# Altium project MainBoard.PrjPCB
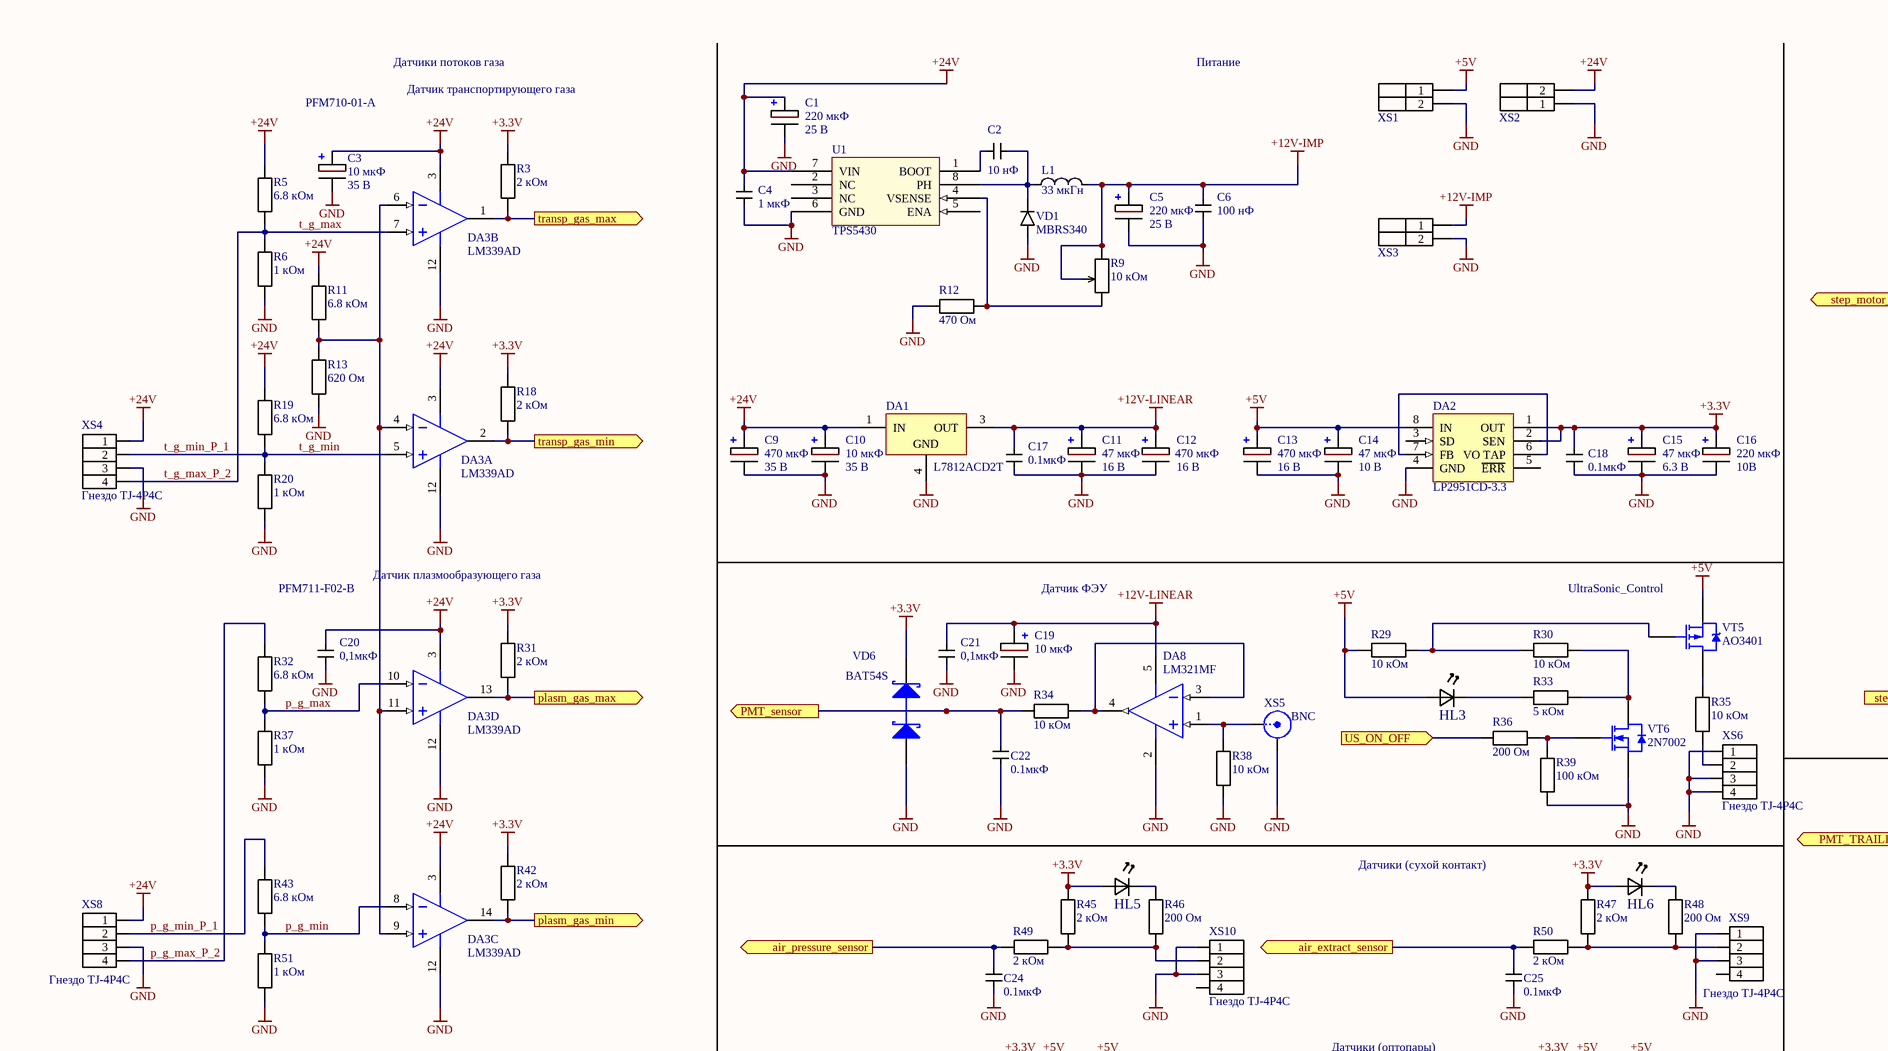
[diagram p0: MainBoard.SchDoc, top left]
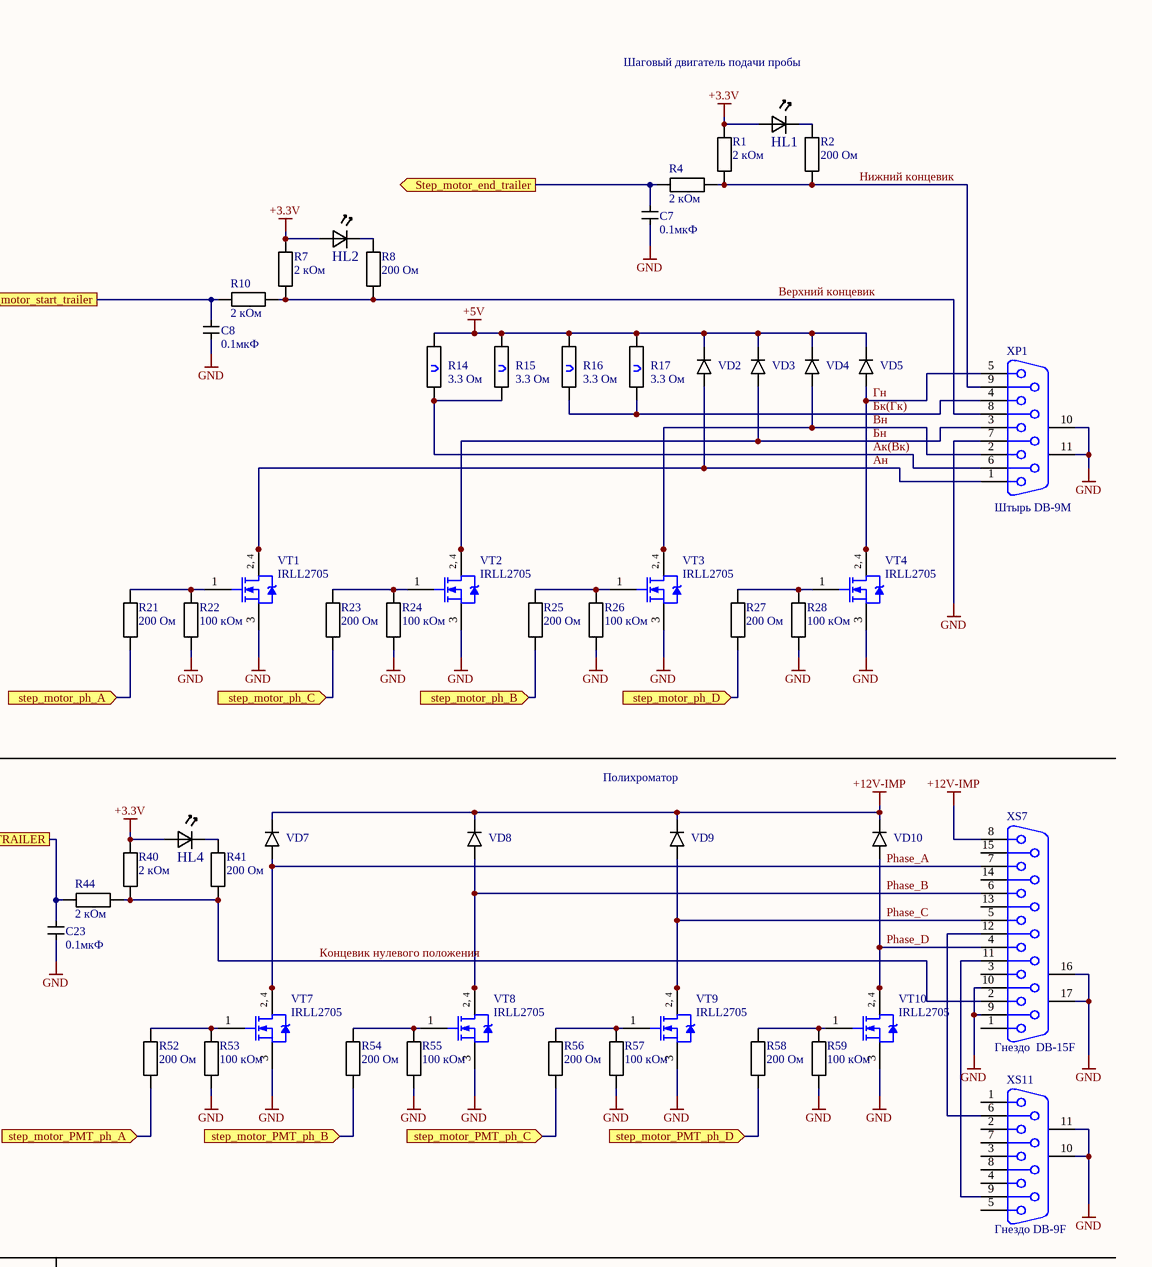
[diagram p1: MainBoard.SchDoc, top right]
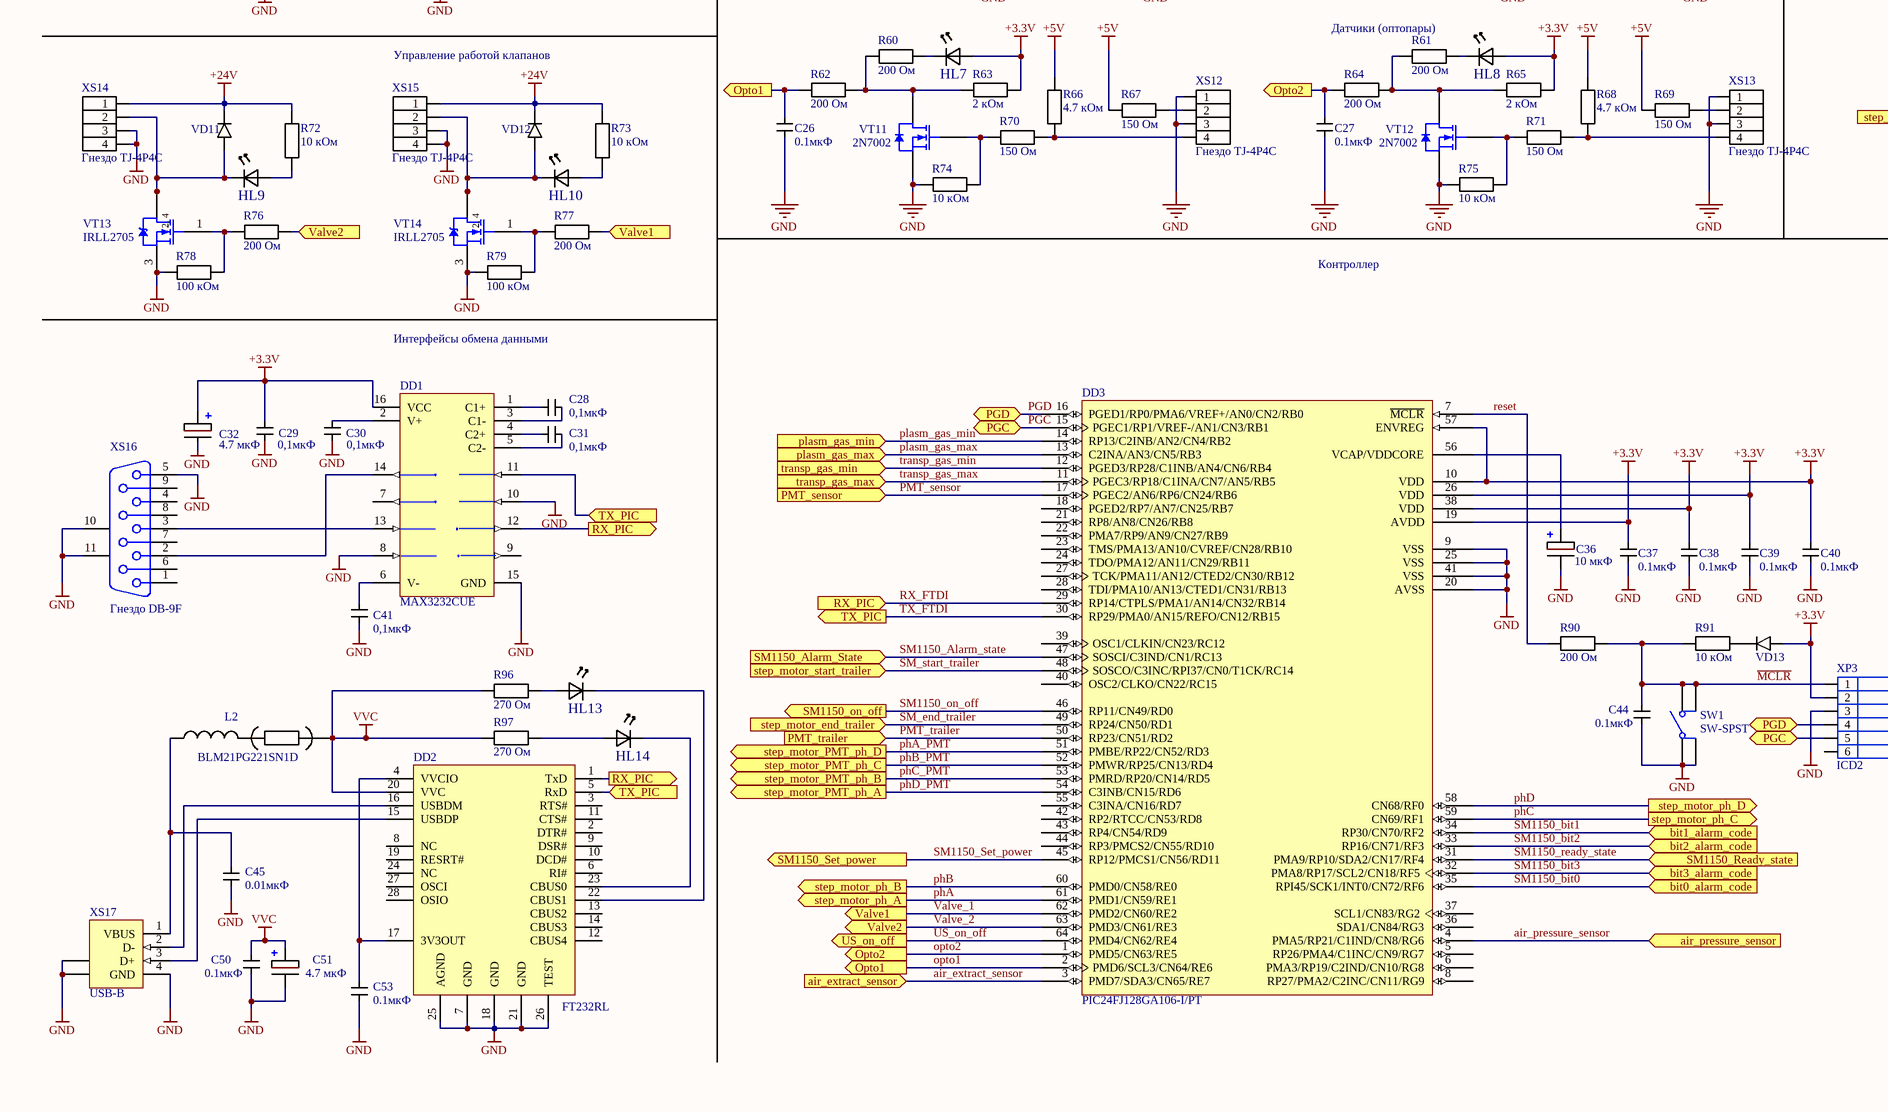
[diagram p2: MainBoard.SchDoc, bottom left]
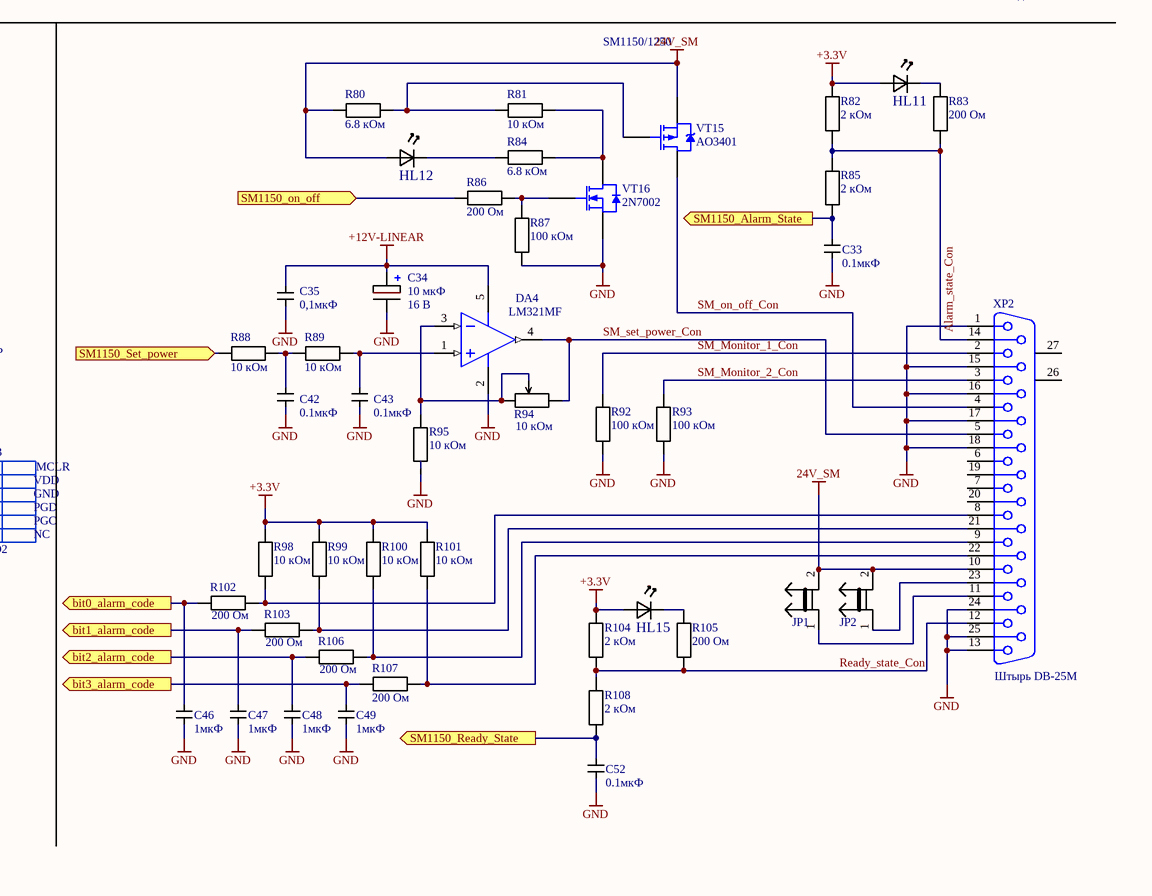
[diagram p3: MainBoard.SchDoc, bottom right]
1 sheet, 239 parts. Net scope: flat (ports and power ports of the same name join across sheets).
Board file: MainBoard.PcbDoc

## Sheet MainBoard.SchDoc
size A2

### Parts
C1  value 220 мкФ  napr: 25 В  [CAPPR5-14x20]  (hidden comment: Конденсатор К50-68)
C2  value 10 нФ  [CC2012-0805]  (hidden comment: Конденсатор ЧИП)
C3  value 10 мкФ  napr: 35 В  [C]  (hidden comment: Tantal C case)
C4  value 1 мкФ  [CC2012-0805]  (hidden comment: Конденсатор ЧИП)
C5  value 220 мкФ  napr: 25 В  [CAPPR5-14x20]  (hidden comment: Конденсатор К50-68)
C6  value 100 нФ  [CC2012-0805]  (hidden comment: Конденсатор ЧИП)
C7  value 0.1мкФ  [CC2012-0805]  (hidden comment: Конденсатор ЧИП)
C8  value 0.1мкФ  [CC2012-0805]  (hidden comment: Конденсатор ЧИП)
C9  value 470 мкФ  napr: 35 В  [CAPPR5-10x20]  (hidden comment: Конденсатор К50-68)
C10  value 10 мкФ  napr: 35 В  [C]  (hidden comment: Tantal C case)
C11  value 47 мкФ  napr: 16 В  [C]  (hidden comment: Tantal C case)
C12  value 470 мкФ  napr: 16 В  [CAPPR5-10x20]  (hidden comment: Конденсатор К50-68)
C13  value 470 мкФ  napr: 16 В  [CAPPR5-10x20]  (hidden comment: Конденсатор К50-68)
C14  value 47 мкФ  napr: 10 В  [B]  (hidden comment: Tantal B case)
C15  value 47 мкФ  napr: 6.3 В  [B]  (hidden comment: Tantal B case)
C16  value 220 мкФ  napr: 10В  [CAPPR2.5-6.3X5]  (hidden comment: Конденсатор К50-68)
C17  value 0.1мкФ  [CC2012-0805]  (hidden comment: Конденсатор ЧИП)
C18  value 0.1мкФ  [CC2012-0805]  (hidden comment: Конденсатор ЧИП)
C19  value 10 мкФ  [B]  (hidden comment: Tantal B case)
C20  value 0,1мкФ  [CC2012-0805]  (hidden comment: Конденсатор ЧИП)
C21  value 0,1мкФ  [CC2012-0805]  (hidden comment: Конденсатор ЧИП)
C22  value 0.1мкФ  [CC2012-0805]  (hidden comment: Конденсатор ЧИП)
C23  value 0.1мкФ  [CC2012-0805]  (hidden comment: Конденсатор ЧИП)
C24  value 0.1мкФ  [CC2012-0805]  (hidden comment: Конденсатор ЧИП)
C25  value 0.1мкФ  [CC2012-0805]  (hidden comment: Конденсатор ЧИП)
C26  value 0.1мкФ  [CC2012-0805]  (hidden comment: Конденсатор ЧИП)
C27  value 0.1мкФ  [CC2012-0805]  (hidden comment: Конденсатор ЧИП)
C28  value 0,1мкФ  [CC2012-0805]  (hidden comment: Конденсатор ЧИП)
C29  value 0,1мкФ  [CC2012-0805]  (hidden comment: Конденсатор ЧИП)
C30  value 0,1мкФ  [CC2012-0805]  (hidden comment: Конденсатор ЧИП)
C31  value 0,1мкФ  [CC2012-0805]  (hidden comment: Конденсатор ЧИП)
C32  value 4.7 мкФ  [B]  (hidden comment: Tantal B case)
C33  value 0.1мкФ  [CC2012-0805]  (hidden comment: Конденсатор ЧИП)
C34  value 10 мкФ  napr: 16 В  [B]  (hidden comment: Tantal B case)
C35  value 0,1мкФ  [CC2012-0805]  (hidden comment: Конденсатор ЧИП)
C36  value 10 мкФ  [B]  (hidden comment: Tantal B case)
C37  value 0.1мкФ  [CC2012-0805]  (hidden comment: Конденсатор ЧИП)
C38  value 0.1мкФ  [CC2012-0805]  (hidden comment: Конденсатор ЧИП)
C39  value 0.1мкФ  [CC2012-0805]  (hidden comment: Конденсатор ЧИП)
C40  value 0.1мкФ  [CC2012-0805]  (hidden comment: Конденсатор ЧИП)
C41  value 0,1мкФ  [CC2012-0805]  (hidden comment: Конденсатор ЧИП)
C42  value 0.1мкФ  [CC2012-0805]  (hidden comment: Конденсатор ЧИП)
C43  value 0.1мкФ  [CC2012-0805]  (hidden comment: Конденсатор ЧИП)
C44  value 0.1мкФ  [CC2012-0805]  (hidden comment: Конденсатор ЧИП)
C45  value 0.01мкФ  [CC2012-0805]  (hidden comment: Конденсатор ЧИП)
C46  value 1мкФ  [CC2012-0805]  (hidden comment: Конденсатор ЧИП)
C47  value 1мкФ  [CC2012-0805]  (hidden comment: Конденсатор ЧИП)
C48  value 1мкФ  [CC2012-0805]  (hidden comment: Конденсатор ЧИП)
C49  value 1мкФ  [CC2012-0805]  (hidden comment: Конденсатор ЧИП)
C50  value 0.1мкФ  [CC2012-0805]  (hidden comment: Конденсатор ЧИП)
C51  value 4.7 мкФ  [B]  (hidden comment: Tantal B case)
C52  value 0.1мкФ  [CC2012-0805]  (hidden comment: Конденсатор ЧИП)
C53  value 0.1мкФ  [CC2012-0805]  (hidden comment: Конденсатор ЧИП)
DA1  L7812ACD2T  [TO-263]
DA2  LP2951CD-3.3  [751-05_N]
DA3  LM339AD  [SO14_N]  (parts A,B,C,D of 4)
DA4  LM321MF  [MF05A_N]
DA8  LM321MF  [MF05A_N]
DD1  MAX3232CUE  [TSSOP16_N]
DD2  FT232RL  [SOP65P760-28L]
DD3  PIC24FJ128GA106-I/PT  [TQFP-PT64_N]
HL1  LED  [LED 2.54mm]  (value not drawn)
HL2  LED  [LED 2.54mm]  (value not drawn)
HL3  LED  [LED 2.54mm]  (value not drawn)
HL4  LED  [LED 2.54mm]  (value not drawn)
HL5  LED  [LED 2.54mm]  (value not drawn)
HL6  LED  [LED 2.54mm]  (value not drawn)
HL7  LED  [LED 2.54mm]  (value not drawn)
HL8  LED  [LED 2.54mm]  (value not drawn)
HL9  LED  [LED 2.54mm]  (value not drawn)
HL10  LED  [LED 2.54mm]  (value not drawn)
HL11  LED  [LED 2.54mm]  (value not drawn)
HL12  LED  [LED 2.54mm]  (value not drawn)
HL13  LED  [LED 2.54mm]  (value not drawn)
HL14  LED  [LED 2.54mm]  (value not drawn)
HL15  LED  [LED 2.54mm]  (value not drawn)
JP1  Перемычка вилка 2x  [HDR2]  (value not drawn)
JP2  Перемычка вилка 2x  [HDR2]  (value not drawn)
L1  value 33 мкГн  [CDRH127]  (hidden comment: Индуктивность CDRH127)
L2  На плате BLM1  [CR2012-0805]  (value not drawn)
R1  value 2 кОм  [CR2012-0805]  (hidden comment: резистор чип)
R2  value 200 Ом  [CR2012-0805]  (hidden comment: резистор чип)
R3  value 2 кОм  [CR2012-0805]  (hidden comment: резистор чип)
R4  value 2 кОм  [CR2012-0805]  (hidden comment: резистор чип)
R5  value 6.8 кОм  [CR2012-0805]  (hidden comment: резистор чип)
R6  value 1 кОм  [CR2012-0805]  (hidden comment: резистор чип)
R7  value 2 кОм  [CR2012-0805]  (hidden comment: резистор чип)
R8  value 200 Ом  [CR2012-0805]  (hidden comment: резистор чип)
R9  value 10 кОм  [3296W]  (hidden comment: Trimming Potentiometer)
R10  value 2 кОм  [CR2012-0805]  (hidden comment: резистор чип)
R11  value 6.8 кОм  [CR2012-0805]  (hidden comment: резистор чип)
R12  value 470 Ом  [CR2012-0805]  (hidden comment: резистор чип)
R13  value 620 Ом  [CR2012-0805]  (hidden comment: резистор чип)
R14  value 3.3 Ом  [SQP5W]  (hidden comment: Резистор 5 Вт)
R15  value 3.3 Ом  [SQP5W]  (hidden comment: Резистор 5 Вт)
R16  value 3.3 Ом  [SQP5W]  (hidden comment: Резистор 5 Вт)
R17  value 3.3 Ом  [SQP5W]  (hidden comment: Резистор 5 Вт)
R18  value 2 кОм  [CR2012-0805]  (hidden comment: резистор чип)
R19  value 6.8 кОм  [CR2012-0805]  (hidden comment: резистор чип)
R20  value 1 кОм  [CR2012-0805]  (hidden comment: резистор чип)
R21  value 200 Ом  [CR2012-0805]  (hidden comment: резистор чип)
R22  value 100 кОм  [CR2012-0805]  (hidden comment: резистор чип)
R23  value 200 Ом  [CR2012-0805]  (hidden comment: резистор чип)
R24  value 100 кОм  [CR2012-0805]  (hidden comment: резистор чип)
R25  value 200 Ом  [CR2012-0805]  (hidden comment: резистор чип)
R26  value 100 кОм  [CR2012-0805]  (hidden comment: резистор чип)
R27  value 200 Ом  [CR2012-0805]  (hidden comment: резистор чип)
R28  value 100 кОм  [CR2012-0805]  (hidden comment: резистор чип)
R29  value 10 кОм  [CR2012-0805]  (hidden comment: резистор чип)
R30  value 10 кОм  [CR2012-0805]  (hidden comment: резистор чип)
R31  value 2 кОм  [CR2012-0805]  (hidden comment: резистор чип)
R32  value 6.8 кОм  [CR2012-0805]  (hidden comment: резистор чип)
R33  value 5 кОм  [CR2012-0805]  (hidden comment: резистор чип)
R34  value 10 кОм  [CR2012-0805]  (hidden comment: резистор чип)
R35  value 10 кОм  [CR2012-0805]  (hidden comment: резистор чип)
R36  value 200 Ом  [CR2012-0805]  (hidden comment: резистор чип)
R37  value 1 кОм  [CR2012-0805]  (hidden comment: резистор чип)
R38  value 10 кОм  [CR2012-0805]  (hidden comment: резистор чип)
R39  value 100 кОм  [CR2012-0805]  (hidden comment: резистор чип)
R40  value 2 кОм  [CR2012-0805]  (hidden comment: резистор чип)
R41  value 200 Ом  [CR2012-0805]  (hidden comment: резистор чип)
R42  value 2 кОм  [CR2012-0805]  (hidden comment: резистор чип)
R43  value 6.8 кОм  [CR2012-0805]  (hidden comment: резистор чип)
R44  value 2 кОм  [CR2012-0805]  (hidden comment: резистор чип)
R45  value 2 кОм  [CR2012-0805]  (hidden comment: резистор чип)
R46  value 200 Ом  [CR2012-0805]  (hidden comment: резистор чип)
R47  value 2 кОм  [CR2012-0805]  (hidden comment: резистор чип)
R48  value 200 Ом  [CR2012-0805]  (hidden comment: резистор чип)
R49  value 2 кОм  [CR2012-0805]  (hidden comment: резистор чип)
R50  value 2 кОм  [CR2012-0805]  (hidden comment: резистор чип)
R51  value 1 кОм  [CR2012-0805]  (hidden comment: резистор чип)
R52  value 200 Ом  [CR2012-0805]  (hidden comment: резистор чип)
R53  value 100 кОм  [CR2012-0805]  (hidden comment: резистор чип)
R54  value 200 Ом  [CR2012-0805]  (hidden comment: резистор чип)
R55  value 100 кОм  [CR2012-0805]  (hidden comment: резистор чип)
R56  value 200 Ом  [CR2012-0805]  (hidden comment: резистор чип)
R57  value 100 кОм  [CR2012-0805]  (hidden comment: резистор чип)
R58  value 200 Ом  [CR2012-0805]  (hidden comment: резистор чип)
R59  value 100 кОм  [CR2012-0805]  (hidden comment: резистор чип)
R60  value 200 Ом  [CR2012-0805]  (hidden comment: резистор чип)
R61  value 200 Ом  [CR2012-0805]  (hidden comment: резистор чип)
R62  value 200 Ом  [CR2012-0805]  (hidden comment: резистор чип)
R63  value 2 кОм  [CR2012-0805]  (hidden comment: резистор чип)
R64  value 200 Ом  [CR2012-0805]  (hidden comment: резистор чип)
R65  value 2 кОм  [CR2012-0805]  (hidden comment: резистор чип)
R66  value 4.7 кОм  [CR2012-0805]  (hidden comment: резистор чип)
R67  value 150 Ом  [CR2012-0805]  (hidden comment: резистор чип)
R68  value 4.7 кОм  [CR2012-0805]  (hidden comment: резистор чип)
R69  value 150 Ом  [CR2012-0805]  (hidden comment: резистор чип)
R70  value 150 Ом  [CR2012-0805]  (hidden comment: резистор чип)
R71  value 150 Ом  [CR2012-0805]  (hidden comment: резистор чип)
R72  value 10 кОм  [CR2012-0805]  (hidden comment: резистор чип)
R73  value 10 кОм  [CR2012-0805]  (hidden comment: резистор чип)
R74  value 10 кОм  [CR2012-0805]  (hidden comment: резистор чип)
R75  value 10 кОм  [CR2012-0805]  (hidden comment: резистор чип)
R76  value 200 Ом  [CR2012-0805]  (hidden comment: резистор чип)
R77  value 200 Ом  [CR2012-0805]  (hidden comment: резистор чип)
R78  value 100 кОм  [CR2012-0805]  (hidden comment: резистор чип)
R79  value 100 кОм  [CR2012-0805]  (hidden comment: резистор чип)
R80  value 6.8 кОм  [CR2012-0805]  (hidden comment: резистор чип)
R81  value 10 кОм  [CR2012-0805]  (hidden comment: резистор чип)
R82  value 2 кОм  [CR2012-0805]  (hidden comment: резистор чип)
R83  value 200 Ом  [CR2012-0805]  (hidden comment: резистор чип)
R84  value 6.8 кОм  [CR2012-0805]  (hidden comment: резистор чип)
R85  value 2 кОм  [CR2012-0805]  (hidden comment: резистор чип)
R86  value 200 Ом  [CR2012-0805]  (hidden comment: резистор чип)
R87  value 100 кОм  [CR2012-0805]  (hidden comment: резистор чип)
R88  value 10 кОм  [CR2012-0805]  (hidden comment: резистор чип)
R89  value 10 кОм  [CR2012-0805]  (hidden comment: резистор чип)
R90  value 200 Ом  [CR2012-0805]  (hidden comment: резистор чип)
R91  value 10 кОм  [CR2012-0805]  (hidden comment: резистор чип)
R92  value 100 кОм  [CR2012-0805]  (hidden comment: резистор чип)
R93  value 100 кОм  [CR2012-0805]  (hidden comment: резистор чип)
R94  value 10 кОм  [3296W]  (hidden comment: Trimming Potentiometer)
R95  value 10 кОм  [CR2012-0805]  (hidden comment: резистор чип)
R96  value 270 Ом  [CR2012-0805]  (hidden comment: резистор чип)
R97  value 270 Ом  [CR2012-0805]  (hidden comment: резистор чип)
R98  value 10 кОм  [CR2012-0805]  (hidden comment: резистор чип)
R99  value 10 кОм  [CR2012-0805]  (hidden comment: резистор чип)
R100  value 10 кОм  [CR2012-0805]  (hidden comment: резистор чип)
R101  value 10 кОм  [CR2012-0805]  (hidden comment: резистор чип)
R102  value 200 Ом  [CR2012-0805]  (hidden comment: резистор чип)
R103  value 200 Ом  [CR2012-0805]  (hidden comment: резистор чип)
R104  value 2 кОм  [CR2012-0805]  (hidden comment: резистор чип)
R105  value 200 Ом  [CR2012-0805]  (hidden comment: резистор чип)
R106  value 200 Ом  [CR2012-0805]  (hidden comment: резистор чип)
R107  value 200 Ом  [CR2012-0805]  (hidden comment: резистор чип)
R108  value 2 кОм  [CR2012-0805]  (hidden comment: резистор чип)
SW1  SW-SPST  [SWT-20]
U1  TPS5430  [SOIC127P600X170_HS-8N]
VD1  MBRS340  [SMC]
VD2  Диод общего применения  [D-64]  (value not drawn)
VD3  Диод общего применения  [D-64]  (value not drawn)
VD4  Диод общего применения  [D-64]  (value not drawn)
VD5  Диод общего применения  [D-64]  (value not drawn)
VD6  BAT54S  [SOT23_N]
VD7  Диод общего применения  [D-64]  (value not drawn)
VD8  Диод общего применения  [D-64]  (value not drawn)
VD9  Диод общего применения  [D-64]  (value not drawn)
VD10  Диод общего применения  [D-64]  (value not drawn)
VD11  Диод общего применения  [D-64]  (value not drawn)
VD12  Диод общего применения  [D-64]  (value not drawn)
VD13  Диод общего применения  [D-64]  (value not drawn)
VT1  IRLL2705  [SOT-223]
VT2  IRLL2705  [SOT-223]
VT3  IRLL2705  [SOT-223]
VT4  IRLL2705  [SOT-223]
VT5  AO3401  [SOT23]
VT6  2N7002  [SOT23_N]
VT7  IRLL2705  [SOT-223]
VT8  IRLL2705  [SOT-223]
VT9  IRLL2705  [SOT-223]
VT10  IRLL2705  [SOT-223]
VT11  2N7002  [SOT23_N]
VT12  2N7002  [SOT23_N]
VT13  IRLL2705  [SOT-223]
VT14  IRLL2705  [SOT-223]
VT15  AO3401  [SOT23]
VT16  2N7002  [SOT23_N]
XP1  name: Штырь DB-9M  [DSUB1.385-2H9]  (hidden comment: Вилка)
XP2  name: Штырь DB-25M  [DSUB1.385-2H25A]  (hidden comment: D Connector 25)
XP3  ICD2  [HDR1X6]
XS1  Клемма DG126-5.0-02P-14  [DG126-5.0-02P-14]  (value not drawn)
XS2  Клемма DG126-5.0-02P-14  [DG126-5.0-02P-14]  (value not drawn)
XS3  Клемма DG126-5.0-02P-14  [DG126-5.0-02P-14]  (value not drawn)
XS4  name: Гнездо TJ-4P4C  [TJ1A]  (hidden comment: Female)
XS5  BNC  [BNC_RA CON]
XS6  name: Гнездо TJ-4P4C  [TJ1A]  (hidden comment: Female)
XS7  name: Гнездо  DB-15F  [DSUB1.385-2H15]  (hidden comment: Гнездо)
XS8  name: Гнездо TJ-4P4C  [TJ1A]  (hidden comment: Female)
XS9  name: Гнездо TJ-4P4C  [TJ1A]  (hidden comment: Female)
XS10  name: Гнездо TJ-4P4C  [TJ1A]  (hidden comment: Female)
XS11  name: Гнездо DB-9F  [DSUB1.385-2H9]  (hidden comment: Гнездо)
XS12  name: Гнездо TJ-4P4C  [TJ1A]  (hidden comment: Female)
XS13  name: Гнездо TJ-4P4C  [TJ1A]  (hidden comment: Female)
XS14  name: Гнездо TJ-4P4C  [TJ1A]  (hidden comment: Female)
XS15  name: Гнездо TJ-4P4C  [TJ1A]  (hidden comment: Female)
XS16  name: Гнездо DB-9F  [DSUB1.385-2H9]  (hidden comment: D Connector 9)
XS17  USB-B  [787780]

### Ports
air_extract_sensor (in), air_extract_sensor (out), air_pressure_sensor (in), air_pressure_sensor (out), bit0_alarm_code (in), bit0_alarm_code (out), bit1_alarm_code (in), bit1_alarm_code (out), bit2_alarm_code (in), bit2_alarm_code (out), bit3_alarm_code (in), bit3_alarm_code (out), Opto1 (out), Opto2 (out), PGC, PGD, plasm_gas_max (in), plasm_gas_max (out), plasm_gas_min (in), plasm_gas_min (out), PMT_sensor (in), PMT_sensor (out), PMT_trailer (in), PMT_TRAILER (out), RX_PIC (in), RX_PIC (out), SM1150_Alarm_State (in), SM1150_Alarm_State (out), SM1150_on_off (in), SM1150_on_off (out), SM1150_Ready_state (in), SM1150_Ready_State (out), SM1150_Set_power (in), SM1150_Set_power (out), step_motor_end_trailer (in), Step_motor_end_trailer (out), step_motor_ph_A (in), step_motor_ph_A (out), step_motor_ph_B (in), step_motor_ph_B (out), step_motor_ph_C (in), step_motor_ph_C (out), step_motor_ph_D (in), step_motor_ph_D (out), step_motor_PMT_ph_A (in), step_motor_PMT_ph_A (out), step_motor_PMT_ph_B (in), step_motor_PMT_ph_B (out), step_motor_PMT_ph_C (in), step_motor_PMT_ph_C (out), step_motor_PMT_ph_D (in), step_motor_PMT_ph_D (out), step_motor_start_trailer (in), step_motor_start_trailer (out), transp_gas_max (in), transp_gas_max (out), transp_gas_min (in), transp_gas_min (out), TX_PIC (in), TX_PIC (out), US_ON_OFF (in), US_on_off (out), Valve1 (in), Valve1 (out), Valve2 (in), Valve2 (out)

### Nets
24V_SM: HL12.1(A) JP1.2 JP2.2 R80.2 VT15.2(S) XP2.10
+3.3V: C15.2(+) C16.1(+) C18.1 C29.2 C32.2(+) C37.2 C38.2 C39.2 C40.2 DA2.1(OUT) DA2.2(SEN) DD1.16(VCC) DD3.10(VDD) DD3.19(AVDD) DD3.26(VDD) DD3.38(VDD) DD3.57(ENVREG) HL1.1(A) HL2.1(A) HL4.1(A) HL5.1(A) HL6.1(A) HL7.1(A) HL8.1(A) HL11.1(A) HL15.1(A) R1.2 R3.1 R7.2 R18.1 R31.1 R40.2 R42.1 R45.2 R47.2 R63.2 R65.2 R82.2 R98.1 R99.1 R100.1 R101.1 R104.2 VD6.2(K) VD13.2(+) XP3.2
+5V: C13.1(+) C14.2(+) DA2.8(IN) HL3.1(A) R14.2 R15.2 R16.2 R17.2 R29.2 R66.2 R67.2 R68.2 R69.2 VD2.1 VD3.1 VD4.1 VD5.1 VT5.2(S) XS1.1
+12V-IMP: C5.1(+) C6.1 L1.2 R9.2 R9.3 VD7.1 VD8.1 VD9.1 VD10.1 XS3.1 XS7.8
+12V-LINEAR: C11.2(+) C12.1(+) C17.2 C19.2(+) C21.2 C34.2(+) C35.2 DA1.3(OUT) DA4.5(V+) DA8.5(V+)
+24V: C1.1(+) C3.2(+) C4.1 C9.1(+) C10.2(+) C20.2 DA1.1(IN) DA3.3(V+) R5.2 R11.2 R19.2 R72.2 R73.2 U1.7(VIN) VD11.1 VD12.1 XS2.2 XS4.1 XS8.1 XS14.1 XS15.1
GND: C1.2(-) C3.1(-) C4.2 C5.2(-) C6.2 C7.1 C8.1 C9.2(-) C10.1(-) C11.1(-) C12.2(-) C13.2(-) C14.1(-) C15.1(-) C16.2(-) C17.1 C18.2 C19.1(-) C20.1 C21.1 C22.1 C23.1 C24.1 C25.1 C26.1 C27.1 C29.1 C30.1 C32.1(-) C33.1 C34.1(-) C35.1 C36.1(-) C37.1 C38.1 C39.1 C40.1 C41.1 C42.1 C43.1 C44.2 C45.1 C46.1 C47.1 C48.1 C49.1 C50.1 C51.1(-) C52.1 C53.1 DA1.4(GND) DA2.4(GND) DA3.12(V-) DA4.2(V-) DA8.2(V-) DD1.8(R2IN) DD1.10(T2IN) DD1.15(GND) DD2.7(GND) DD2.18(GND) DD2.21(GND) DD2.25(AGND) DD2.26(TEST) DD3.9(VSS) DD3.20(AVSS) DD3.25(VSS) DD3.41(VSS) R6.2 R12.1 R13.2 R20.2 R22.1 R24.1 R26.1 R28.1 R37.2 R38.2 R39.2 R51.2 R53.1 R55.1 R57.1 R59.1 R74.1 R75.1 R78.1 R79.1 R87.2 R92.2 R93.2 R95.2 SW1.1(COMMON) SW1.3 U1.6(GND) VD1.2(+) VD6.1(A) VT1.3(S) VT2.3(S) VT3.3(S) VT4.3(S) VT6.2(S) VT7.3(S) VT8.3(S) VT9.3(S) VT10.3(S) VT11.2(S) VT12.2(S) VT13.3(S) VT14.3(S) VT16.2(S) XP1.7 XP1.10(MH1) XP1.11(MH2) XP2.1 XP2.13 XP2.15 XP2.16 XP2.17 XP2.18 XP2.24 XP2.25 XP3.3 XS1.2 XS2.1 XS3.2 XS4.3 XS5.2(Y) XS6.1 XS6.3 XS6.4 XS7.9 XS7.10 XS7.16(MH1) XS7.17(MH2) XS8.3 XS9.1 XS9.3 XS10.1 XS10.3 XS11.10(MH1) XS11.11(MH2) XS12.1 XS12.3 XS13.1 XS13.3 XS14.3 XS14.4 XS15.3 XS15.4 XS16.5 XS16.10(MH1) XS16.11(MH2) XS17.4(GND) XS17.5(SHLD) XS17.6(SHLD)
VVC: C50.2 C51.2(+) DD2.20(VVC) L2.2 R96.1 R97.1
air_extract_sensor: C25.2 DD3.3(PMD7/SDA3/CN65/RE7) R50.2 ; port air_extract_sensor
air_pressure_sensor: C24.2 DD3.4(PMA5/RP21/C1IND/CN8/RG6) R49.2 ; port air_pressure_sensor
Alarm_state_Con: R82.1 R83.2 R85.1 XP2.14
~{MCLR}: C44.1 R90.1 R91.1 SW1.2(NO) SW1.4 XP3.1
opto1: C26.2 DD3.2(PMD6/SCL3/CN64/RE6) R62.1 ; port Opto1
opto2: C27.2 DD3.1(PMD5/CN63/RE5) R64.2 ; port Opto2
p_g_max: DA3.10(IN-) R32.1 R37.1
p_g_max_P_2: R32.2 XS8.4
p_g_min: DA3.8(IN-) R43.1 R51.1
p_g_min_P_1: R43.2 XS8.2
PGC: DD3.15(PGEC1/RP1/VREF-/AN1/CN3/RB1) XP3.5 ; port PGC
PGD: DD3.16(PGED1/RP0/PMA6/VREF+/AN0/CN2/RB0) XP3.4 ; port PGD
phA: DD3.61(PMD1/CN59/RE1) R21.2 ; port step_motor_ph_A
phA_PMT: DD3.51(PMBE/RP22/CN52/RD3) R58.1 ; port step_motor_PMT_ph_D
Phase_A: VD7.2(+) VT7.2(D) VT7.4(D) XS7.7
Phase_B: VD8.2(+) VT8.2(D) VT8.4(D) XS7.6
Phase_C: VD9.2(+) VT9.2(D) VT9.4(D) XS7.5
Phase_D: VD10.2(+) VT10.2(D) VT10.4(D) XS7.4
phB: DD3.60(PMD0/CN58/RE0) R25.1 ; port step_motor_ph_B
phB_PMT: DD3.52(PMWR/RP25/CN13/RD4) R56.1 ; port step_motor_PMT_ph_C
phC: DD3.59(CN69/RF1) R23.1 ; port step_motor_ph_C
phC_PMT: DD3.53(PMRD/RP20/CN14/RD5) R54.1 ; port step_motor_PMT_ph_B
phD: DD3.58(CN68/RF0) R27.1 ; port step_motor_ph_D
phD_PMT: DD3.54(C3INB/CN15/RD6) R52.1 ; port step_motor_PMT_ph_A
plasm_gas_max: DA3.13(OUT) DD3.13(C2INA/AN3/CN5/RB3) R31.2 ; port plasm_gas_max
plasm_gas_min: DA3.14(OUT) DD3.14(RP13/C2INB/AN2/CN4/RB2) R42.2 ; port plasm_gas_min
PMT_sensor: C22.2 DD3.17(PGEC2/AN6/RP6/CN24/RB6) R34.2 VD6.3(C) ; port PMT_sensor
PMT_trailer: C23.2 DD3.50(RP23/CN51/RD2) R44.2 ; port PMT_TRAILER, port PMT_trailer
Ready_state_Con: R104.1 R105.2 R108.1 XP2.12
reset: DD3.7(~{MCLR}) R90.2
RX_FTDI: DD1.12(R1OUT) DD2.1(TxD) DD3.29(RP14/CTPLS/PMA1/AN14/CN32/RB14) ; port RX_PIC
SM1150_Alarm_state: C33.2 DD3.47(SOSCI/C3IND/CN1/RC13) R85.2 ; port SM1150_Alarm_State
SM1150_bit0: C46.2 DD3.35(RPI45/SCK1/INT0/CN72/RF6) R102.2 ; port bit0_alarm_code
SM1150_bit1: C47.2 DD3.34(RP30/CN70/RF2) R103.2 ; port bit1_alarm_code
SM1150_bit2: C48.2 DD3.33(RP16/CN71/RF3) R106.2 ; port bit2_alarm_code
SM1150_bit3: C49.2 DD3.32(PMA8/RP17/SCL2/CN18/RF5) R107.2 ; port bit3_alarm_code
SM1150_on_off: DD3.46(RP11/CN49/RD0) R86.1 ; port SM1150_on_off
SM1150_ready_state: C52.2 DD3.31(PMA9/RP10/SDA2/CN17/RF4) R108.2 ; port SM1150_Ready_State, port SM1150_Ready_state
SM1150_Set_power: DD3.45(RP12/PMCS1/CN56/RD11) R88.1 ; port SM1150_Set_power
SM_end_trailer: C7.2 DD3.49(RP24/CN50/RD1) R4.2 ; port Step_motor_end_trailer, port step_motor_end_trailer
SM_Monitor_1_Con: R92.1 XP2.2
SM_Monitor_2_Con: R93.1 XP2.3
SM_on_off_Con: VT15.3(D) XP2.4
SM_set_power_Con: DA4.4(OUT) R94.3 XP2.5
SM_start_trailer: C8.2 DD3.48(SOSCO/C3INC/RPI37/CN0/T1CK/RC14) R10.2 ; port step_motor_start_trailer
t_g_max: DA3.7(IN+) R5.1 R6.1 XS4.4  [also labelled t_g_max_P_2]
t_g_min: DA3.5(IN+) R19.1 R20.1 XS4.2  [also labelled t_g_min_P_1]
transp_gas_max: DA3.1(OUT) DD3.11(PGEC3/RP18/C1INA/CN7/AN5/RB5) R3.2 ; port transp_gas_max
transp_gas_min: DA3.2(OUT) DD3.12(PGED3/RP28/C1INB/AN4/CN6/RB4) R18.2 ; port transp_gas_min
TX_FTDI: DD1.11(T1IN) DD2.5(RxD) DD3.30(RP29/PMA0/AN15/REFO/CN12/RB15) ; port TX_PIC
US_on_off: DD3.64(PMD4/CN62/RE4) R36.1 ; port US_ON_OFF, port US_on_off
Valve_1: DD3.62(PMD2/CN60/RE2) R77.1 ; port Valve1
Valve_2: DD3.63(PMD3/CN61/RE3) R76.1 ; port Valve2
Ак(Вк): R14.1 R15.1 XP1.6
Ан: VD2.2(+) VT1.2(D) VT1.4(D) XP1.1
Бк(Гк): R16.1 R17.1 XP1.4
Бн: VD3.2(+) VT2.2(D) VT2.4(D) XP1.3
Верхний концевик: R7.1 R8.2 R10.1 XP1.8
Вн: VD4.2(+) VT3.2(D) VT3.4(D) XP1.2
Гн: VD5.2(+) VT4.2(D) VT4.4(D) XP1.5
Концевик нулевого положения: R40.1 R41.2 R44.1 XS7.2
Нижний концевик: R1.1 R2.2 R4.1 XP1.9
NetC2_1: C2.1 L1.1 U1.8(PH) VD1.1(-)
NetC2_2: C2.2 U1.1(BOOT)
NetC28_1: C28.1 DD1.3(C1-)
NetC28_2: C28.2 DD1.1(C1+)
NetC30_2: C30.2 DD1.2(V+)
NetC31_1: C31.1 DD1.5(C2-)
NetC31_2: C31.2 DD1.4(C2+)
NetC36_2: C36.2(+) DD3.56(VCAP/VDDCORE)
NetC41_2: C41.2 DD1.6(V-)
NetC42_2: C42.2 R88.2 R89.1
NetC43_2: C43.2 DA4.1(IN+) R89.2
NetC45_2: C45.2 L2.1 XS17.1(VBUS)
NetC53_2: C53.2 DD2.4(VVCIO) DD2.17(3V3OUT)
NetDA2_6: DA2.6(VO_TAP) DA2.7(FB)
NetDA3_4: DA3.4(IN-) DA3.6(IN-) DA3.9(IN+) DA3.11(IN+) R11.1 R13.1
NetDA4_3: DA4.3(IN-) R94.1 R94.2 R95.1
NetDA8_1: DA8.1(IN+) R38.1 XS5.1(X)
NetDA8_3: DA8.3(IN-) DA8.4(OUT) R34.1
NetDD1_13: DD1.13(R1IN) XS16.3
NetDD1_14: DD1.14(T1OUT) XS16.2
NetDD2_15: DD2.15(USBDP) XS17.3(D+)
NetDD2_16: DD2.16(USBDM) XS17.2(D-)
NetDD2_22: DD2.22(CBUS1) HL13.2(K)
NetDD2_23: DD2.23(CBUS0) HL14.2(K)
NetHL1_2: HL1.2(K) R2.1
NetHL2_2: HL2.2(K) R8.1
NetHL3_2: HL3.2(K) R33.2
NetHL4_2: HL4.2(K) R41.1
NetHL5_2: HL5.2(K) R46.1
NetHL6_2: HL6.2(K) R48.1
NetHL7_2: HL7.2(K) R60.1
NetHL8_2: HL8.2(K) R61.1
NetHL9_1: HL9.1(A) R72.1
NetHL9_2: HL9.2(K) VD11.2(+) VT13.2(D) VT13.4(D) XS14.2
NetHL10_1: HL10.1(A) R73.1
NetHL10_2: HL10.2(K) VD12.2(+) VT14.2(D) VT14.4(D) XS15.2
NetHL11_2: HL11.2(K) R83.1
NetHL12_2: HL12.2(K) R84.2
NetHL13_1: HL13.1(A) R96.2
NetHL14_1: HL14.1(A) R97.2
NetHL15_2: HL15.2(K) R105.1
NetJP1_1: JP1.1 XP2.11
NetJP2_1: JP2.1 XP2.23
NetR9_1: R9.1 R12.2 U1.4(VSENSE)
NetR21_1: R21.1 R22.2 VT1.1(G)
NetR23_2: R23.2 R24.2 VT2.1(G)
NetR25_2: R25.2 R26.2 VT3.1(G)
NetR27_2: R27.2 R28.2 VT4.1(G)
NetR29_1: R29.1 R30.2 VT5.1(G)
NetR30_1: R30.1 R33.1 VT6.3(D)
NetR35_1: R35.1 VT5.3(D)
NetR35_2: R35.2 XS6.2
NetR36_2: R36.2 R39.1 VT6.1(G)
NetR45_1: R45.1 R46.2 R49.1 XS10.2
NetR47_1: R47.1 R48.2 R50.1 XS9.2
NetR52_2: R52.2 R53.2 VT7.1(G)
NetR54_2: R54.2 R55.2 VT8.1(G)
NetR56_2: R56.2 R57.2 VT9.1(G)
NetR58_2: R58.2 R59.2 VT10.1(G)
NetR60_2: R60.2 R62.2 R63.1 VT11.3(D)
NetR61_2: R61.2 R64.1 R65.1 VT12.3(D)
NetR66_1: R66.1 R70.2 XS12.4
NetR67_1: R67.1 XS12.2
NetR68_1: R68.1 R71.2 XS13.4
NetR69_1: R69.1 XS13.2
NetR70_1: R70.1 R74.2 VT11.1(G)
NetR71_1: R71.1 R75.2 VT12.1(G)
NetR76_2: R76.2 R78.2 VT13.1(G)
NetR77_2: R77.2 R79.2 VT14.1(G)
NetR80_1: R80.1 R81.2 VT15.1(G)
NetR81_1: R81.1 R84.1 VT16.3(D)
NetR86_2: R86.2 R87.1 VT16.1(G)
NetR91_2: R91.2 VD13.1
NetR98_2: R98.2 R102.1 XP2.8
NetR99_2: R99.2 R103.1 XP2.21
NetR100_2: R100.2 R106.1 XP2.9
NetR101_2: R101.2 R107.1 XP2.22
NetXS7_11: XS7.11 XS11.9
NetXS7_12: XS7.12 XS11.6

Not connected (* = marked no-connect by the designer): DA2 3(SD) 5(~{ERR}); DD1 7(T2OUT) 9(R2OUT); DD2 2(DTR#) 3(RTS#) 6(RI#) 8(NC) 9(DSR#) 10(DCD#) 11(CTS#) 12(CBUS4) 13(CBUS2) 14(CBUS3) 19(RESRT#) 24(NC) 27(OSCI) 28(OSIO); DD3 5(RP26/PMA4/C1INC/CN9/RG7) 6(PMA3/RP19/C2IND/CN10/RG8) 8(RP27/PMA2/C2INC/CN11/RG9) 18(PGED2/RP7/AN7/CN25/RB7) 21(RP8/AN8/CN26/RB8) 22(PMA7/RP9/AN9/CN27/RB9) 23(TMS/PMA13/AN10/CVREF/CN28/RB10) 24(TDO/PMA12/AN11/CN29/RB11) 27(TCK/PMA11/AN12/CTED2/CN30/RB12) 28(TDI/PMA10/AN13/CTED1/CN31/RB13) 36(SDA1/CN84/RG3) 37(SCL1/CN83/RG2) 39(OSC1/CLKIN/CN23/RC12) 40(OSC2/CLKO/CN22/RC15) 42(RP2/RTCC/CN53/RD8) 43(RP4/CN54/RD9) 44(RP3/PMCS2/CN55/RD10) 55(C3INA/CN16/RD7); U1 2(NC) 3(NC) 5(ENA); XP2 6 7 19 20 26(MH1) 27(MH2); XP3 6; XS7 1 3 13 14 15; XS9 4; XS10 4; XS11 1 2 3 4 5 7 8; XS16 1 4 6 7 8 9

### Notes on the sheet
- PFM710-01-A
- Датчики потоков газа
- Датчик транспортирующего газа
- Питание
- Шаговый двигатель подачи пробы
- PFM711-F02-B
- Датчик плазмообразующего газа
- Датчик ФЭУ
- UltraSonic_Control
- Полихроматор
- Датчики (сухой контакт)
- Датчики (оптопары)
- Управление работой клапанов
- Контроллер
- SM1150/1250
- Интерфейсы обмена данными
- (in symbol ICD2) MCLR; VDD; GND; PGD; PGC; NC
- (in symbol IRLL2705) 2, 4

### Library data of the parts
C1 C5 C9 C12 C13 C16 = Конденсатор К50-68: Электролитический конденсатор; dopusk: +80-20%; type: Конденсаторы; codegr: 1002060109; name: К50-68; enter: *
C2 C4 C6-C8 C17 C18 C20-C31 C33 C35 C37-C50 C52 C53 = Конденсатор ЧИП: Чип конденсатор; name: ЧИП-0805-X7R; dopusk: ±10%; type: Конденсаторы; codegr: 1002060122; enter: *
C3 C10 C11 = Tantal C case: Конденсатор танталовый LowESR; name: Тантал. ЧИП C case (B45197A); dopusk: ±20%; type: Конденсаторы; codegr: 1002060122; enter: *
C14 C15 C34 = Tantal B case: Конденсатор танталовый LowESR; name: Тантал. ЧИП B case (B45197A); dopusk: ±20%; type: Конденсаторы; codegr: 1002060122; enter: *
C19 C36 = Tantal B case: Конденсатор танталовый LowESR; name: Тантал. ЧИП B case (B45197A); dopusk: ±20%; type: Конденсаторы; napr: 16 В; codegr: 1002060122; enter: *
C32 C51 = Tantal B case: Конденсатор танталовый LowESR; name: Тантал. ЧИП B case (B45197A); dopusk: ±20%; type: Конденсаторы; napr: 6.3 В; codegr: 1002060122; enter: *
DA1 = L7812ACD2T: Precision 1A Regulator; Published: 24-Aug-2001; LatestRevisionDate: 17-Jul-2002; LatestRevisionNote: Re-released for DXP Platform.; DatasheetVersion: Nov-1999; PackageReference: TO-263; Publisher: Altium Limited; PackageDescription: D2-PAK/TO-263-AB; 3 Leads (1 Cropped); Body 15.9 (inc. leads) x 10.4 mm (LxW max); ComponentLink1Description: Manufacturer Link; ComponentLink1URL: http://www.st.com/; ComponentLink2Description: Datasheet; ComponentLink2URL: http://www.st.com/stonline/products/literature/ds/2144/l7805ab.pdf; name: L7812ACD2T; type: Микросхемы аналоговые
DA2 = LP2951CD-3.3: MicroPower Voltage Regulator; Published: 15-Apr-2002; LatestRevisionDate: 13-Apr-2006; LatestRevisionNote: IPC-7351 Footprint Added.; DatasheetVersion: Oct-1999; PackageVersion: 1998; PackageReference: 751-05; Publisher: Altium Limited; PackageDescription: 8-Pin Small Outline Integrated Circuit 1.27 mm Pitch; Code_JEDEC: MS-012-AA; Code_IPC: SOIC127P600-8; ComponentLink1Description: Manufacturer Link; ComponentLink1URL: http://www.onsemi.com/site/products/taxonomy/0,4438,503,00.html; ComponentLink2Description: Datasheet; ComponentLink2URL: http://www.onsemi.com/pub/Collateral/LP2950-D.PDF; name: LP2951CD-3.3; type: Микросхемы аналоговые
DA3 = LM339AD: Low-Power Quad Voltage Comparator; Published: 24-Aug-2001; LatestRevisionDate: 13-Apr-2006; LatestRevisionNote: IPC-7351 Footprint Added.; DatasheetVersion: Jun-1998; PackageVersion: Sep-1998; PackageReference: SO14; Publisher: Altium Limited; PackageDescription: 14-Pin Small Outline Integrated Circuit 1.27 mm Pitch; Code_IPC: SOIC127P600-14; ComponentLink1Description: Manufacturer Link; ComponentLink1URL: http://www.st.com/; ComponentLink2Description: Datasheet; ComponentLink2URL: http://www.st.com/stonline/products/literature/ds/2159/lm239.pdf; name: LM339AD; type: Микросхемы аналоговые
DA4 DA8 = LM321MF: Low Power Single Op Amp; Manufacturer: National Semiconductor; CompType: Amplifiers; PackageTopMarking: A63A*XTT; PowerWise: N; Published: 4-Dec-2008; LatestRevisionDate: 13-Jan-2009; LatestRevisionNote: Sim Model Added.; DatasheetVersion: Apr-2001; PackageVersion: revD, Aug-2008; PackageReference: MF05A; Publisher: Altium Limited; PackageDescription: Molded SOT-23, .115 x .063 x .040 in Body, 5 Lead, .0375 in Pitch; PartNumber: LM321MF; RoHS: O; PinCount: 5; DigiKeyPartNumber: LM321MFCT-ND; Code_IPC: SOT23-5; ComponentLink1Description: LM321 Datasheet; ComponentLink1URL: http://www.national.com/ds/LM/LM321.pdf; ComponentLink2Description: LM321 Web Page; ComponentLink2URL: http://www.national.com/pf/LM/LM321.html; ComponentLink3Description: MF05A Package Page; ComponentLink3URL: http://www.national.com/packaging/folders/mf05a.html; name: LM321MF; type: Микросхемы аналоговые
DD1 = MAX3232CUE: 3.0V TO 5.5V, Low-Power, up to 1Mbps, True RS-232 Transceiver Using Four 0.1µF External Capacitor; Published: 16-Jan-2001; LatestRevisionDate: 29-May-2009; LatestRevisionNote: IPC-7351 Footprint Added.; DatasheetVersion: Mar-1999; PackageVersion: 21-0066 C; PackageReference: TSSOP16; Publisher: Altium Limited; PackageDescription: 16-Pin Thin Small Outline Package 0.65 mm Pitch; ComponentLink1Description: Manufacturer Link; ComponentLink1URL: http://www.maxim-ic.com/; ComponentLink2Description: Datasheet; ComponentLink2URL: http://pdfserv.maxim-ic.com/en/ds/MAX3222-MAX3241.pdf; name: MAX3232CUE; type: Микросхемы цифровые
DD3 = PIC24FJ128GA106-I/PT: General Purpose 16-Bit Flash Microcontroller, 128KB Flash, 16KB SRAM, 64-Pin TQFP, Industrial Temperature; Published: 29-Jan-2009; DatasheetVersion: revB, Feb-2008; PackageVersion: revAW, Oct-2008; PackageReference: TQFP-PT64; Publisher: Altium Limited; PackageDescription: 64-Lead Thin Plastic Quad Flat Pack (PT) - 10x10x1mm Body, 2.00mm [TQFP]; Code_JEDEC: MS-026; ComponentLink1Description: Manufacturer Link; ComponentLink1URL: http://www.microchip.com; ComponentLink2Description: Datasheet; ComponentLink2URL: http://ww1.microchip.com/downloads/en/DeviceDoc/39905b.pdf; ComponentLink3Description: Packaging Specification; ComponentLink3URL: http://ww1.microchip.com/downloads/en/PackagingSpec/00049AW.pdf; name: PIC24FJ128GA106-I/PT; type: Микросхемы цифровые
HL1-HL15 = LED: name: Светодиод GNL-3012HD; type: Устройства индикационные и сигнальные
JP1 JP2 = Перемычка вилка 2x: name: Штырь PLS2; codegr: *; dopusk: *; enter: *; napr: *; type: Соединения контактные; value: *
L1 = Индуктивность CDRH127: type: Катушки индуктивности; Name: CDRH127
L2 = BLM: name: Дроссель подавления ЭМП BLM21AG102SN1; type: Дроссели; text1: (Resistance element becomes; text2: dominant  at high frequencies.)
R1-R8 R10-R13 R18-R93 R95-R108 = Резистор ЧИП: name: ЧИП-0805; dopusk: ±5%; codegr: 100206060405; type: Резисторы; enter: *
R9 R94 = Резистор переменный 3296W: name: Переменный резистор 3296; type: Резисторы
R14-R17 = Резистор 5 Вт: name: SQP-5W; dopusk: ±5%; enter: 5Вт; codegr: 100206060404; type: Резисторы
SW1 = SW-SPST: Single-Pole, Single-Throw Switch; Published: 24-Mar-1999; LatestRevisionDate: 17-Jul-2002; LatestRevisionNote: Re-released for DXP Platform.; PackageReference: SPST-2; Publisher: Altium Limited; name: SW-SPST; type: Выключатели кнопочные
VD1 = Диод MBRS340: Диод; type: Диоды; name: MBRS340
VD2-VD5 VD7-VD13 = 10MQ100N: чип диод; type: Диоды; codegr: 1002060402; name: 10mq100N; value: *; dopusk: *; enter: *
VD6 = BAT54S: Schottky Barrier Double Diode; type: Диоды; Published: 17-Sep-2003; LatestRevisionDate: 12-Dec-2006; LatestRevisionNote: IPC-7351 Footprint Added.; DatasheetVersion: 4-Mar-2002; PackageVersion: May-1999; PackageReference: SOT23; Publisher: Altium Limited; PackageDescription: 3-Pin SOT-23 Package 0.95 mm Pitch, 2.3 mm Lead Span; ComponentLink1Description: Manufacturer Link; ComponentLink1URL: http://www.semiconductors.philips.com/; ComponentLink2Description: Datasheet; ComponentLink2URL: http://www.semiconductors.philips.com/acrobat/datasheets/BAT54_SERIES_4.pdf; name: BAT54S
VT1-VT4 VT7-VT10 VT13 VT14 = IRLL2705: HEXFET Power MOSFET; Note: Pin 2 is electrically connected to pin 4.; type: транзисторы; Published: 8-Jun-2000; LatestRevisionDate: 17-Jul-2002; LatestRevisionNote: Re-released for DXP Platform.; DatasheetVersion: Jan-1999; PackageReference: SOT-223; Publisher: Altium Limited; PackageDescription: SOT-223/SC-73; 4 Leads; Body 6.7 x 7.3 mm, inc. leads (LxW max); Code_JEDEC: TO-261-AA; Code_IPC: SOT 223; ComponentLink1Description: Manufacturer Link; ComponentLink1URL: http://www.irf.com/; ComponentLink2Description: Datasheet; ComponentLink2URL: http://www.irf.com/product-info/datasheets/data/irll2705.pdf; name: IRLL2705
VT5 VT15 = AO3401: type: транзисторы; name: AO3401
VT6 VT11 VT12 VT16 = 2N7002: N-channel Enhancement Mode Field-effect Transistor; type: транзисторы; Published: 17-Sep-2003; LatestRevisionDate: 12-Dec-2006; LatestRevisionNote: IPC-7351 Footprint Added.; DatasheetVersion: 27-Jul-2000; PackageVersion: May-1999; PackageReference: SOT23; Publisher: Altium Limited; PackageDescription: 3-Pin SOT-23 Package 0.95 mm Pitch, 2.3 mm Lead Span; ComponentLink1Description: Manufacturer Link; ComponentLink1URL: http://www.semiconductors.philips.com/; ComponentLink2Description: Datasheet; ComponentLink2URL: http://www.semiconductors.philips.com/acrobat/datasheets/2N7002_4.pdf; name: 2N7002
XP1 XS11 XS16 = D Connector 9: Receptacle Assembly, 9 Position, Right Angle; PackageDocument: O; Positions: 9; Published: 15-Jun-2001; LatestRevisionDate: 17-Jul-2002; LatestRevisionNote: Re-released for DXP Platform.; DatasheetDocument: 1-Sep-1999; PackageReference: 788750; Publisher: Altium Limited; Orientation: Right Angle; Gender: Receptacle
  XP1 XS11: type: Соединения контактные
XP2 = D Connector 25: Receptacle Assembly, 25 Position, Right Angle; PackageDocument: U; Positions: 25; Published: 15-Jun-2001; LatestRevisionDate: 17-Jul-2002; LatestRevisionNote: Re-released for DXP Platform.; DatasheetDocument: 19-Mar-1999; PackageReference: 787202; Publisher: Altium Limited; Orientation: Right Angle; Gender: Receptacle; type: Соединения контактные
XP3 = ICD2: name: Штырь IDC2; type: Соединения контактные
XS1-XS3 = DG126-5.0-02P-14: Name: Гнездо DG126-5.0-0.2P-14; type: Соединения контактные
XS4 XS6 XS8-XS10 XS12-XS15 = TJ-4P4C: type: Соединения контактные
XS5 = BNC: BNC Elbow Connector; name: Гнездо BNC; LatestRevisionDate: 17-Jul-2002; LatestRevisionNote: Re-released for DXP Platform.; Publisher: Altium Limited; type: Соединения контактные
XS7 = D Connector 15: Receptacle Assembly, 15 Position, Right Angle; PackageDocument: O; Positions: 15; Published: 15-Jun-2001; LatestRevisionDate: 17-Jul-2002; LatestRevisionNote: Re-released for DXP Platform.; DatasheetDocument: 1-Sep-99; PackageReference: 788757; Publisher: Altium Limited; Orientation: Right Angle; Gender: Receptacle; type: Соединения контактные
XS17 = 787780-1: USB 1.1, Right Angle, Thru-Hole, B Type, Receptacle, 4 Position, Black; ContactMaterial: Copper Alloy; ContactPlating: Gold Flash over Palladium Nickel or Gold (30) over Nickel; TerminationLength: 3.00mm [0.118in.]; PCB_Layout: Complies with manufacturer's recommendation.; DrillSize: Corresponds to nominal value.; PanelGround: Without; name: Гнездо USB-B; Published: 15-Jul-2004; DatasheetDocument: 11-Jan-2004; PackageDocument: 11-Jan-2004; PackageReference: Гнездо USB-B; Publisher: Altium Limited; HousingMaterial: Thermoplastic; ComponentLink1Description: Manufacturer Link; ComponentLink1URL: http://www.tycoelectronics.com/; ComponentLink2Description: Packaging Specification; ComponentLink2URL: http://ecommas.tycoelectronics.com/commerce/DocumentDelivery/DDEController?Action=showdoc&DocId=Customer+Drawing%7F787780%7FF%7Ftif%7FEnglish%7FENG_CD_787780_F.tif; type: Соединения контактные
DD2 = FT232RL: name: FT232RL; type: Микросхемы цифровые
U1 = TPS5430: name: TPS5430; type: Микросхемы аналоговые